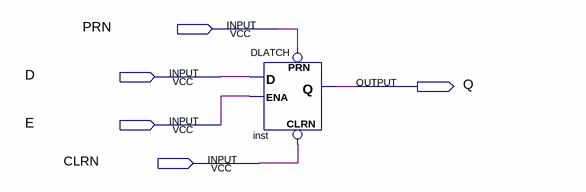
[diagram p0: schematic sheet]
// Quartus schematic Emdad_03_14_2022_d_latch.bdf as structural Verilog: 1 symbols, 5 pins
module Emdad_03_14_2022_d_latch (
  input  PRN,
  input  D,
  input  E,
  input  CLRN,
  output Q
);

  DLATCH inst (.CLRN(CLRN), .D(D), .ENA(E), .PRN(PRN), .Q(Q));
endmodule
